# Altium schematic sheet DAC.SchDoc: Digital to Analog Converter
size A4; Date: 27.09.2023; ApprovedBy: M.Sc. Tobias Wirth; CheckedBy: M.Sc. Tobias Wirth; Author: M.Sc. Tobias Wirth; CompanyName: University of Stuttgart; DrawnBy: M.Sc. Tobias Wirth; Engineer: M.Sc. Tobias Wirth; Organization: IIS; Address1: Pfaffenwaldring 47; Address2: 70569 Stuttgart; Revision: V1.5; SheetNumber: 5; SheetTotal: 17; ProjectNameAlt: AUS - NMR System; Time: 15:20; ImagePath: N/A; Application_BuildNumber: N/A
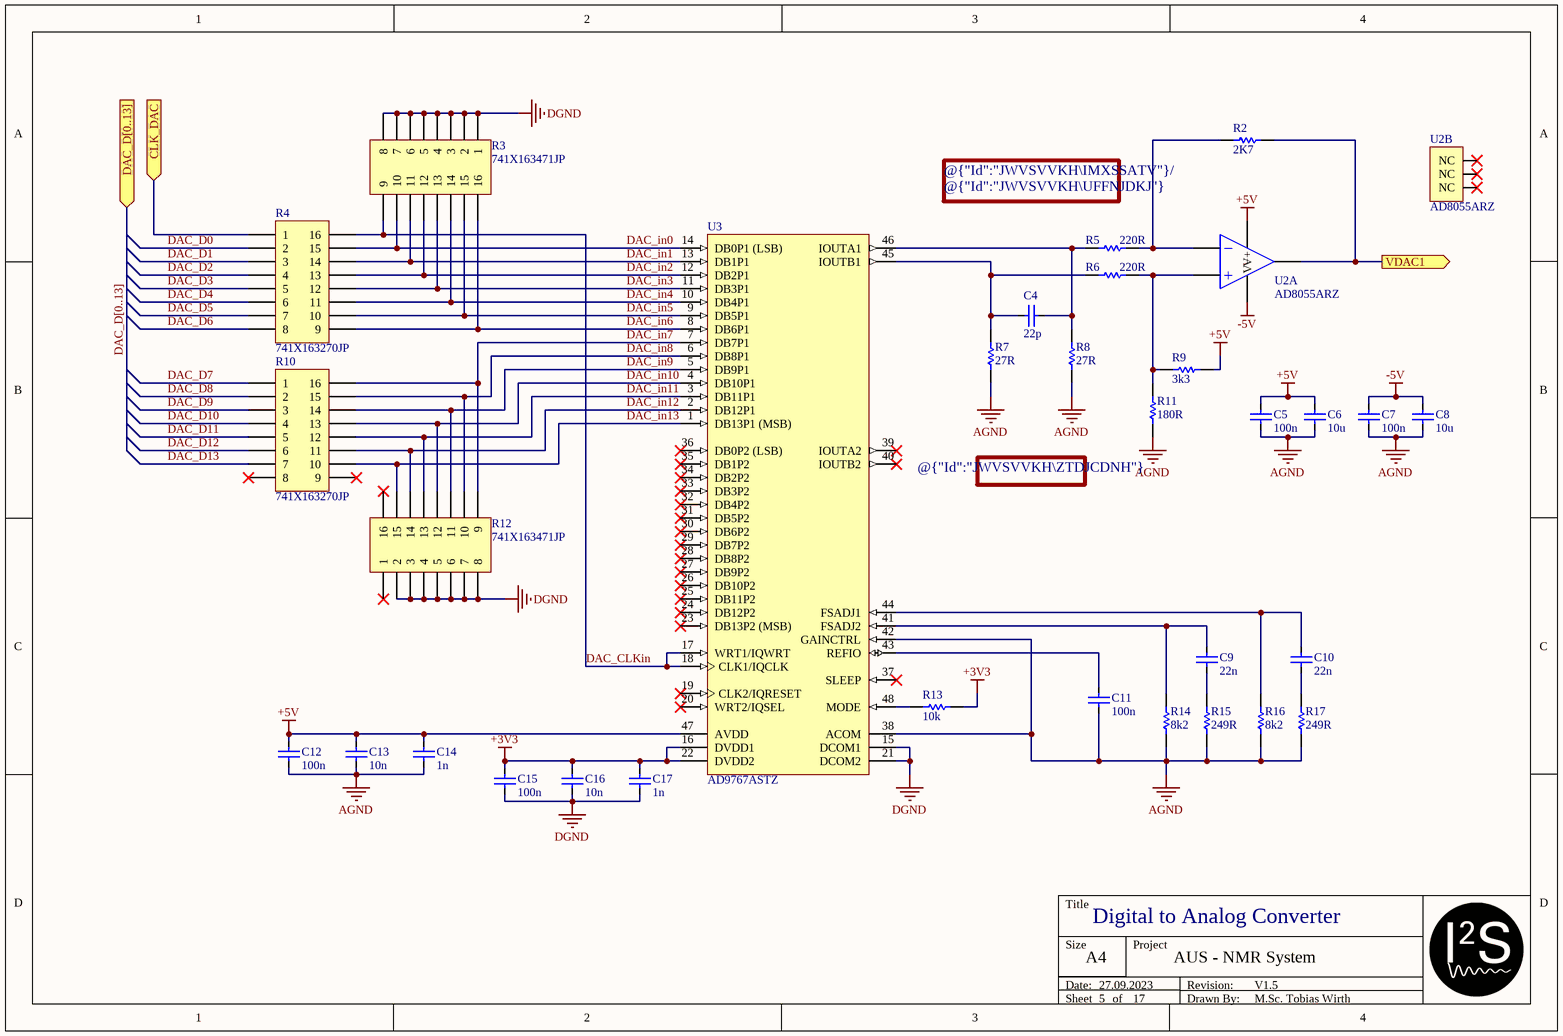
[diagram p0: DAC.SchDoc]

## Parts
C4  22p  [CAP_0402]
C5  100n  [CAP_0402]
C6  10u  [CAP_0603]
C7  100n  [CAP_0402]
C8  10u  [CAP_0603]
C9  22n  [CAP_0402]
C10  22n  [CAP_0402]
C11  100n  [CAP_0402]
C12  100n  [CAP_0402]
C13  10n  [CAP_0402]
C14  1n  [CAP_0402]
C15  100n  [CAP_0402]
C16  10n  [CAP_0402]
C17  1n  [CAP_0402]
R2  2K7  [RES_0402]
R3  741X163471JP  [741X163]
R4  741X163270JP  [741X163]
R5  220R  [RES_0402]
R6  220R  [RES_0402]
R7  27R  [RES_0402]
R8  27R  [RES_0402]
R9  3k3  [RES_0402]
R10  741X163270JP  [741X163]
R11  180R  [RES_0402]
R12  741X163471JP  [741X163]
R13  10k  [RES_0402]
R14  8k2  [RES_0402]
R15  249R  [RES_0402]
R16  8k2  [RES_0402]
R17  249R  [RES_0402]
U2  AD8055ARZ  [SOIC127P600X175-8N]  (parts A,B of 2)
U3  AD9767ASTZ  [TQFP-48_L]

## Ports
CLK_DAC (in), DAC_D[0..13] (in), VDAC1 (out)

## Nets
+3V3: C15.1 C16.1 C17.1 R13.1 U3.16(DVDD1) U3.22(DVDD2)
+5V: C5.1 C6.1 C12.1 C13.1 C14.1 R9.1 U2.7(V+) U3.47(AVDD)
-5V: C7.1 C8.1 U2.4(V−)
AGND: C5.2 C6.2 C7.2 C8.2 C11.2 C12.2 C13.2 C14.2 R7.1 R8.1 R11.1 R14.1 R15.1 R16.1 R17.1 U3.38(ACOM) U3.42(GAINCTRL)
DGND: C15.2 C16.2 C17.2 R3.1 R3.2 R3.3 R3.4 R3.5 R3.6 R3.7 R3.8 R12.2 R12.3 R12.4 R12.5 R12.6 R12.7 R12.8 U3.15(DCOM1) U3.21(DCOM2)
CLK_DAC: R4.1 ; port CLK_DAC
DAC_CLKin: R3.9 R4.16 U3.17(WRT1/IQWRT) U3.18(CLK1/IQCLK)
DAC_D0: R4.2
DAC_D1: R4.3
DAC_D2: R4.4
DAC_D3: R4.5
DAC_D4: R4.6
DAC_D5: R4.7
DAC_D6: R4.8
DAC_D7: R10.1
DAC_D8: R10.2
DAC_D9: R10.3
DAC_D10: R10.4
DAC_D11: R10.5
DAC_D12: R10.6
DAC_D13: R10.7
DAC_in0: R3.10 R4.15 U3.14(DB0P1_(LSB))
DAC_in1: R3.11 R4.14 U3.13(DB1P1)
DAC_in2: R3.12 R4.13 U3.12(DB2P1)
DAC_in3: R3.13 R4.12 U3.11(DB3P1)
DAC_in4: R3.14 R4.11 U3.10(DB4P1)
DAC_in5: R3.15 R4.10 U3.9(DB5P1)
DAC_in6: R3.16 R4.9 U3.8(DB6P1)
DAC_in7: R10.16 R12.9 U3.7(DB7P1)
DAC_in8: R10.15 R12.10 U3.6(DB8P1)
DAC_in9: R10.14 R12.11 U3.5(DB9P1)
DAC_in10: R10.13 R12.12 U3.4(DB10P1)
DAC_in11: R10.12 R12.13 U3.3(DB11P1)
DAC_in12: R10.11 R12.14 U3.2(DB12P1)
DAC_in13: R10.10 R12.15 U3.1(DB13P1_(MSB))
VDAC1: R2.2 U2.6 ; port VDAC1
NetC4_1: C4.1 R5.2 R8.2 U3.46(IOUTA1)
NetC4_2: C4.2 R6.2 R7.2 U3.45(IOUTB1)
NetC9_1: C9.1 R14.2 U3.41(FSADJ2)
NetC9_2: C9.2 R15.2
NetC10_1: C10.1 R16.2 U3.44(FSADJ1)
NetC10_2: C10.2 R17.2
NetC11_1: C11.1 U3.43(REFIO)
NetR2_1: R2.1 R5.1 U2.2(−)
NetR6_1: R6.1 R9.2 R11.2 U2.3(+)
NetR13_2: R13.2 U3.48(MODE)

Not connected (* = marked no-connect by the designer): R10 8* 9*; R12 1* 16*; U2 1(NC)* 5(NC)* 8(NC)*; U3 19(CLK2/IQRESET)* 20(WRT2/IQSEL)* 23(DB13P2_(MSB))* 24(DB12P2)* 25(DB11P2)* 26(DB10P2)* 27(DB9P2)* 28(DB8P2)* 29(DB7P2)* 30(DB6P2)* 31(DB5P2)* 32(DB4P2)* 33(DB3P2)* 34(DB2P2)* 35(DB1P2)* 36(DB0P2_(LSB))* 37(SLEEP)* 39(IOUTA2)* 40(IOUTB2)*

## Buses and harness runs
bus DAC_D[0..13] = port DAC_D[0..13]

## Notes on the sheet
- @{"Id":"JWVSVVKH\IMXSSATV"}/ @{"Id":"JWVSVVKH\UFFNJDKJ"} sets the gain
  @{"Id":"JWVSVVKH\NLDPBRXG"}/ @{"Id":"JWVSVVKH\IJMLKELA"} sets the DC lvl
- @{"Id":"JWVSVVKH\ZTDJCDNH"} ist optional
- Title
- Size
- Date:
- Sheet
- A4
- of
- Project
- Drawn By:
- Revision:

## Library data of the parts
C4-C17 = Cap: Supplier: *; Part Number: *
  C4: Value: 22p
  C5 C7 C11 C12 C15: Value: 100n
  C6 C8: Value: 10u
  C9 C10: Value: 22n
  C13 C16: Value: 10n
  C14 C17: Value: 1n
R2 R5-R9 R11 R13-R17 = Res: Part Number: *; Supplier: *
  R2: Value: 2K7
  R5 R6: Value: 220R
  R7 R8: Value: 27R
  R9: Value: 3k3
  R11: Value: 180R
  R13: Value: 10k
  R14 R16: Value: 8k2
  R15 R17: Value: 249R
R3 R4 R10 R12 = 741X163: Isolated 8 Resistor Network/Array, Convex, Long Side Terminals; Supplier 1: Mouser
  R3 R12: Supplier Part Number 1: 774-741X163471JP
  R4 R10: Supplier Part Number 1: 774-741X163270JP
U2 = AD8055: 300 MHz Voltage Feedback Amplifier; Supplier 1: Mouser; Supplier Part Number 1: 584-AD8055ARZ
U3 = AD9767: Dual 14-Bit TxDAC+, 125 Msps, -40 to +85 degC, ST-48, Pb-Free, Tray; Manufacturer: Analog Devices; Single Supply: Yes; Resolution (Bits): 14; Settling Time: 35ns; Max V+: 5.5V; Op Pwr Diss: 450mW; # DAC Outputs: 2; ComponentLink2Description: Datasheet; ComponentLink2URL: http://www.analog.com/static/imported-files/data_sheets/AD9763_9765_9767.pdf; ComponentLink4URL: http://www.analog.com/en/digital-to-analog-converters/da-converters/ad9767/products/product.html; ComponentLink4Description: Product URL; Packing: Tray; DatasheetVersion: Rev.G; PackageReference: ST-48; RoHS: Y; Generic Part Number: AD9767; ComponentLink3URL: http://www.analog.com/static/imported-files/packages/PKG_PDF/LQFP%28ST%29/ST_48.pdf; ComponentLink1URL: http://www.analog.com/en/index.html; RevisionNote: Component URL fixed; PartNumber: AD9767ASTZ; Mounting Technology: Surface Mount; PackageVersion: revA; ComponentLink1Description: Manufacturer URL; PackageDescription: 48-Pin Thin Quad Flat Pack 0.5 mm Pitch; ComponentLink3Description: Package Specification; Supplier 1: Digi-Key; Supplier Part Number 1: 505-AD9767ASTZ-ND